# EAGLE schematic RPi-HAT_BUS-Controller_V0.3 (EAGLE 7.4.0)
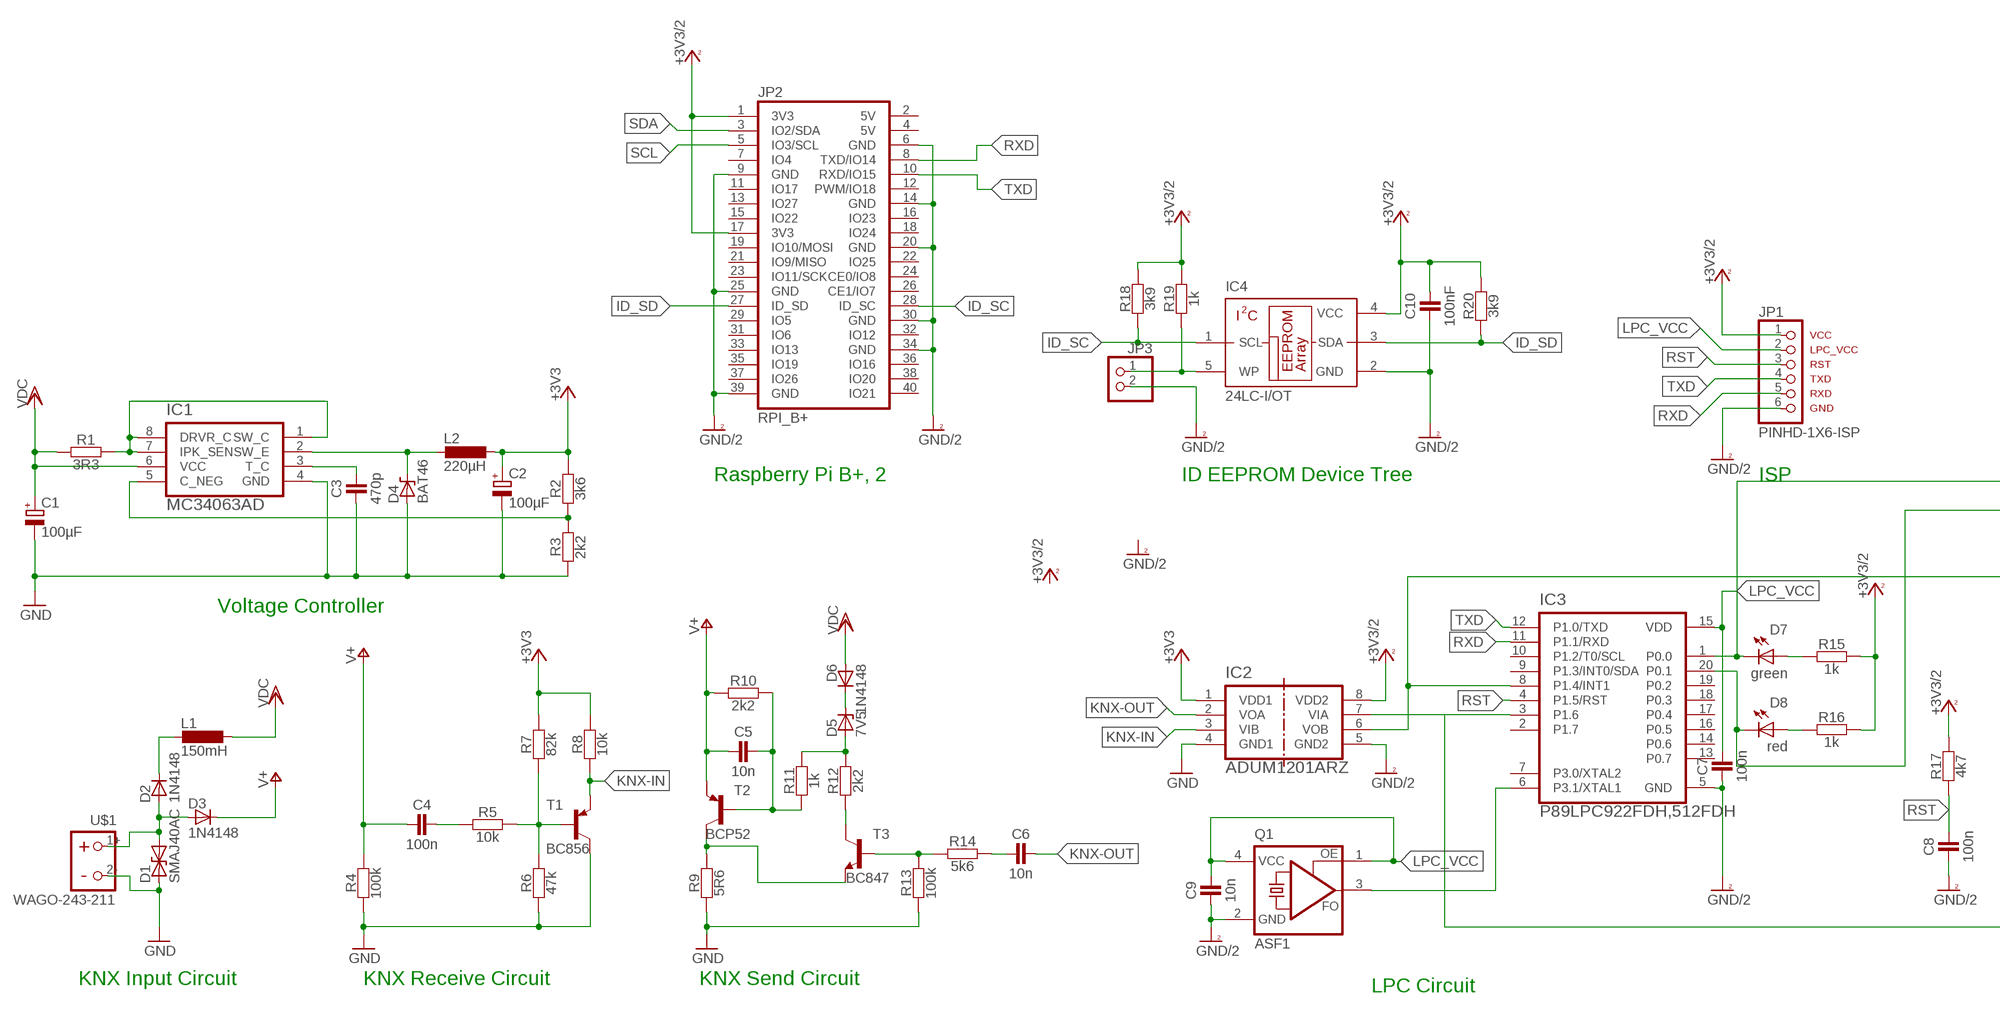
[diagram p0: schematic, sheet 1, part 1 of 2]
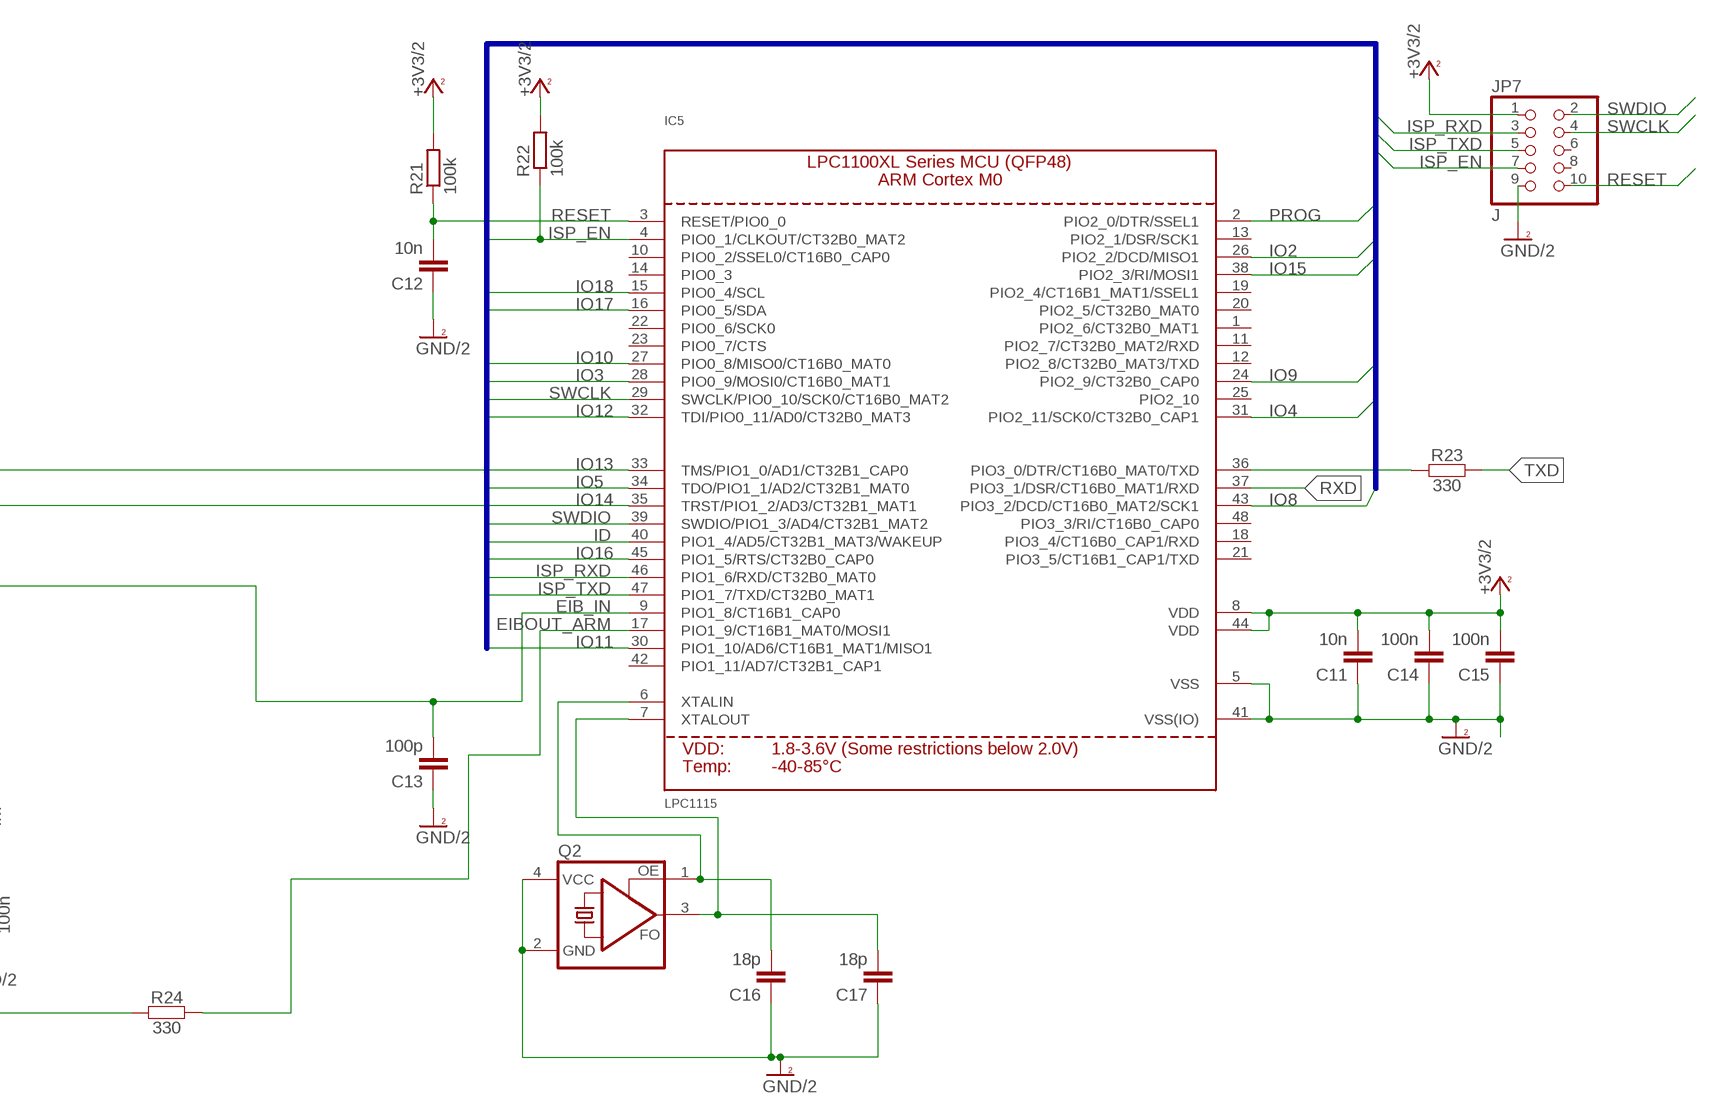
[diagram p1: schematic, sheet 1, part 2 of 2]

## Parts
C1  100µF  100µF,35V  [PANASONIC_D]
C2  100µF  100µF,6.3V  [PANASONIC_C]
C3  470p  CAPACITORC1206  [R1206]
C4  100n  CAPACITORC1206  [R1206]
C5  10n  CAPACITORC1206  [R1206]
C6  10n  CAPACITORC1206  [R1206]
C7  100n  CAPACITORC1206  [R1206]
C8  100n  CAPACITORC1206  [R1206]
C9  10n  CAPACITORC1206  [R1206]
C10  100nF  CAPACITORC1206  [R1206]
C11  10n  C-EUC1206  [C1206]
C12  10n  C-EUC1206  [C1206]
C13  100p  C-EUC1206  [C1206]
C14  100n  C-EUC1206  [C1206]
C15  100n  C-EUC1206  [C1206]
C16  18p  C-EUC1206  [C1206]
C17  18p  C-EUC1206  [C1206]
D1  SMAJ40AC  [DO-214AC]
D2  1N4148  1N4148MINIMELF  [MINIMELF]
D3  1N4148  1N4148MINIMELF  [MINIMELF]
D4  BAT46  [MINIMELF]
D5  7V5  Z-DIODE  [MINIMELF]
D6  1N4148  1N4148MINIMELF  [MINIMELF]
D7  green  LED1206  [CHIPLED_1206]
D8  red  LED1206  [CHIPLED_1206]
IC1  MC34063AD  [SOIC127P600X175-8N]
IC2  ADUM1201ARZ  [SOIC127P600X175-8N]
IC3  P89LPC922FDH,512FDH  [SOP65P640X110-20N]
IC4  24LC-I/OT  [SOT23-5]
IC5  LPC1115  LPC1113/4/5_QFP48_XLSERIES  [LQFP48]
JP1  PINHD-1X6-ISP  [1X06]
JP2  RPI_B+  [RPI-B+HAT]
JP3  PINHD-1X2  [1X02]
JP7  J  PINHD-2X05_2.00  [2X05M]
L1  150mH  150MH-L11PL1  [11P-L1]
L2  220µH  220µH-SMCC11.43  [2200-11.43]
Q1  ASF1  [ASF]
Q2  ASFL  [ASF]
R1  3R3  RESISTORR1206  [R1206]
R2  3k6  RESISTORR1206  [R1206]
R3  2k2  RESISTORR1206  [R1206]
R4  100k  RESISTORR1206  [R1206]
R5  10k  RESISTORR1206  [R1206]
R6  47k  RESISTORR1206  [R1206]
R7  82k  RESISTORR1206  [R1206]
R8  10k  RESISTORR1206  [R1206]
R9  5R6  RESISTORR1206  [R1206]
R10  2k2  RESISTORR1206  [R1206]
R11  1k  RESISTORR1206  [R1206]
R12  2k2  RESISTORR1206  [R1206]
R13  100k  RESISTORR1206  [R1206]
R14  5k6  RESISTORR1206  [R1206]
R15  1k  RESISTORR1206  [R1206]
R16  1k  RESISTORR1206  [R1206]
R17  4k7  RESISTORR1206  [R1206]
R18  3k9  RESISTORR1206  [R1206]
R19  1k  RESISTORR1206  [R1206]
R20  3k9  RESISTORR1206  [R1206]
R21  100k  R-EU_R1206  [R1206]
R22  100k  R-EU_R1206  [R1206]
R23  330  RESISTORR1206  [R1206]
R24  330  RESISTORR1206  [R1206]
T1  BC856  PNPBC856  [SOT23]
T2  BCP52  PNPBCP52  [SOT223]
T3  BC847  NPN-BC847  [SOT23]
U$1  WAGO-243-211  [WAGO-243-211]

## Nets
+3V3: C2.+ IC2.1(VDD1) L2.1 R2.2 R7.2 R8.2
+3V3/2: C10.2 C11.2 C14.2 C15.2 IC2.8(VDD2) IC4.4(VCC) IC5.8(VDD) IC5.44(VDD) JP1.1 JP2.1(3V3) JP2.17(3V3) JP7.1 R15.2 R16.2 R17.2 R18.2 R19.2 R20.2 R21.2 R22.2
EIB_IN: C13.2 IC2.6(VOB) IC3.8(P1.4/INT1) IC5.9(PIO1_8/CT16B1_CAP0)
EIB_OUT: IC2.7(VIA) IC3.3(P1.6) R24.1
EIBOUT_ARM: IC5.17(PIO1_9/CT16B1_MAT0/MOSI1) R24.2
GND: C1.- C2.- C3.1 D1.A D4.A IC1.4(GND) IC2.4(GND1) R3.1 R4.1 R6.1 R9.1 R13.1 T1.3(C) U$1.2-
GND/2: C7.1 C8.1 C9.1 C10.1 C11.1 C12.1 C13.1 C14.1 C15.1 C16.1 C17.1 IC2.5(GND2) IC3.5(GND) IC4.2(GND) IC5.5(VSS) IC5.41(VSS(IO)) JP1.6 JP2.6(GND) JP2.9(GND) JP2.14(GND) JP2.20(GND) JP2.25(GND) JP2.30(GND) JP2.34(GND) JP2.39(GND) JP3.2 JP7.9 Q1.2(GND) Q2.2(GND) Q2.4(VCC)
ID: IC5.40(PIO1_4/AD5/CT32B1_MAT3/WAKEUP)
ID_SC: IC4.1(SCL) JP2.28(ID_SC) R18.1
ID_SD: IC4.3(SDA) JP2.27(ID_SD) R20.1
IO2: IC5.26(PIO2_2/DCD/MISO1)
IO3: IC5.28(PIO0_9/MOSI0/CT16B0_MAT1)
IO4: IC5.31(PIO2_11/SCK0/CT32B0_CAP1)
IO5: IC5.34(TDO/PIO1_1/AD2/CT32B1_MAT0)
IO8: IC5.43(PIO3_2/DCD/CT16B0_MAT2/SCK1)
IO9: IC5.24(PIO2_9/CT32B0_CAP0)
IO10: IC5.27(PIO0_8/MISO0/CT16B0_MAT0)
IO11: IC5.30(PIO1_10/AD6/CT16B1_MAT1/MISO1)
IO12: D8.C IC3.20(P0.1) IC5.32(TDI/PIO0_11/AD0/CT32B0_MAT3)
IO13: IC5.33(TMS/PIO1_0/AD1/CT32B1_CAP0)
IO14: IC5.35(TRST/PIO1_2/AD3/CT32B1_MAT1)
IO15: D7.C IC3.1(P0.0) IC5.38(PIO2_3/RI/MOSI1)
IO16: IC5.45(PIO1_5/RTS/CT32B0_CAP0)
IO17: IC5.16(PIO0_5/SDA)
IO18: IC5.15(PIO0_4/SCL)
ISP_EN: IC5.4(PIO0_1/CLKOUT/CT32B0_MAT2) JP7.7 R22.1
ISP_RXD: IC5.46(PIO1_6/RXD/CT32B0_MAT0) JP7.3
ISP_TXD: IC5.47(PIO1_7/TXD/CT32B0_MAT1) JP7.5
KNX-IN: IC2.3(VIB) R8.1 T1.2(E)
KNX-OUT: C6.2 IC2.2(VOA)
LPC_VCC: C7.2 C9.2 IC3.15(VDD) JP1.2 Q1.1(OE) Q1.4(VCC)
N$1: D1.C D2.A D3.A U$1.1+
N$2: C16.2 IC5.6(XTALIN) Q2.1(OE)
N$3: IC1.5(C_NEG) R2.1 R3.2
N$4: C4.2 R5.1
N$5: D2.C L1.2
N$6: R5.2 R6.2 R7.1 T1.1(B)
N$7: C17.2 IC5.7(XTALOUT) Q2.3(FO)
N$8: IC1.1(SW_C) IC1.7(IPK_SEN) IC1.8(DRVR_C) R1.2
N$10: C3.2 IC1.3(T_C)
N$12: IC4.5(WP) JP3.1 R19.1
N$13: D4.C IC1.2(SW_E) L2.2
N$23: R9.2 T2.2(C) T2.4(C) T3.2(E)
N$24: C5.2 R10.2 R11.1 T2.1(B)
N$25: D5.A R11.2 R12.2
N$26: R12.1 T3.3(C)
N$28: R13.2 R14.1 T3.1(B)
N$29: C6.1 R14.2
N$31: D5.C D6.C
N$32: IC3.6(P3.1/XTAL1) Q1.3(FO)
N$35: D7.A R15.1
N$38: D8.A R16.1
PROG: IC5.2(PIO2_0/DTR/SSEL1)
RESET: C12.2 IC5.3(RESET/PIO0_0) JP7.10 R21.1
RST: C8.2 IC3.4(P1.5/RST) JP1.3 R17.1
RXD: IC3.11(P1.1/RXD) IC5.37(PIO3_1/DSR/CT16B0_MAT1/RXD) JP1.5 JP2.8(TXD/IO14)
SCL: JP2.5(IO3/SCL)
SDA: JP2.3(IO2/SDA)
SWCLK: IC5.29(SWCLK/PIO0_10/SCK0/CT16B0_MAT2) JP7.4
SWDIO: IC5.39(SWDIO/PIO1_3/AD4/CT32B1_MAT2) JP7.2
TXD: IC3.12(P1.0/TXD) JP1.4 JP2.10(RXD/IO15) R23.2
TXD_ARM: IC5.36(PIO3_0/DTR/CT16B0_MAT0/TXD) R23.1
V+: C4.1 C5.1 D3.C R4.2 R10.1 T2.3(E)
VDD: C1.+ D6.A IC1.6(VCC) L1.1 R1.1 ; supply symbol labelled VDC
Unconnected: IC3.2(P1.7) IC3.7(P3.0/XTAL2) IC3.9(P1.3/INT0/SDA) IC3.10(P1.2/T0/SCL) IC3.13(P0.7) IC3.14(P0.6) IC3.16(P0.5) IC3.17(P0.4) IC3.18(P0.3) IC3.19(P0.2) IC5.1(PIO2_6/CT32B0_MAT1) IC5.10(PIO0_2/SSEL0/CT16B0_CAP0) IC5.11(PIO2_7/CT32B0_MAT2/RXD) IC5.12(PIO2_8/CT32B0_MAT3/TXD) IC5.13(PIO2_1/DSR/SCK1) IC5.14(PIO0_3) IC5.18(PIO3_4/CT16B0_CAP1/RXD) IC5.19(PIO2_4/CT16B1_MAT1/SSEL1) IC5.20(PIO2_5/CT32B0_MAT0) IC5.21(PIO3_5/CT16B1_CAP1/TXD) IC5.22(PIO0_6/SCK0) IC5.23(PIO0_7/CTS) IC5.25(PIO2_10) IC5.42(PIO1_11/AD7/CT32B1_CAP1) IC5.48(PIO3_3/RI/CT16B0_CAP0) JP2.2(5V) JP2.4(5V) JP2.7(IO4) JP2.11(IO17) JP2.12(PWM/IO18) JP2.13(IO27) JP2.15(IO22) JP2.16(IO23) JP2.18(IO24) JP2.19(IO10/MOSI) JP2.21(IO9/MISO) JP2.22(IO25) JP2.23(IO11/SCK) JP2.24(CE0/IO8) JP2.26(CE1/IO7) JP2.29(IO5) JP2.31(IO6) JP2.32(IO12) JP2.33(IO13) JP2.35(IO19) JP2.36(IO16) JP2.37(IO26) JP2.38(IO20) JP2.40(IO21) JP7.6 JP7.8

## Buses
IO[1..18],RESET,SWCLK,SWDIO,ISP_EN,PROG,ID,ISP_TXD,ISP_RXD

## Notes on the sheet
- Raspberry Pi B+, 2 | ID EEPROM Device Tree | ISP
- Voltage Controller
- KNX Input Circuit | KNX Receive Circuit | KNX Send Circuit
- LPC Circuit

## Library data of the parts
C1 = RCL_for_Selfbus-Projects:100µF,35V: Polarized Capacitor 100µF, 35V
C2 = RCL_for_Selfbus-Projects:100µF,6.3V: Polarized Capacitor 100µF, 6.3V
C3-C10 = RCL_for_Selfbus-Projects:CAPACITOR: Capacitor
C11 C12 = rcl:C-EU: CAPACITOR, European symbol; REICHELT: X7R-G0805 10N
C13 = rcl:C-EU: CAPACITOR, European symbol; REICHELT: NPO-G0805 100P
C14 C15 = rcl:C-EU: CAPACITOR, European symbol; REICHELT: X7R-G0805 100N
C16 C17 = rcl:C-EU: CAPACITOR, European symbol
D1 = Diode:SMAJ40AC
D2 D3 = Diode:1N4148
D4 = Diode_for_Selfbus-Projects:BAT46: Schottky Diode
D5 = Diode_for_Selfbus-Projects:Z-DIODE: Z-Diode
D6 = Diode_for_Selfbus-Projects:1N4148: Diode
D7 D8 = Diode_for_Selfbus-Projects:LED: LED
IC1 = IC_for_Selfbus-Projects:MC34063A: DC/DC converter control circuit
IC2 = IC_for_Selfbus-Projects:ADUM1201ARZ: Dual-Channel Digital Isolators; MPN: ADUM1201ARZ; OC_FARNELL: 1078200; OC_NEWARK: 19M0753; PACKAGE: SOIC-8; SUPPLIER: Analog Devices
IC3 = IC_for_Selfbus-Projects:P89LPC922FDH,512: 8-bit microcontrollers with two-clock 80C51 core 2 kB/4 kB/8 kB 3 V low-power Flash with 256-byte data RAM; MPN: P89LPC922FDH,512; OC_FARNELL: 1895067; OC_NEWARK: 70R8570; PACKAGE: TSSOP-20; SUPPLIER: NXP
IC4 = IC_for_Selfbus-Projects:24LC*: Microchip I2C EEPROM 2 Kbit - 24LC02B - 24LC02BT-I/OTDKR-ND 32 Kbit- 24LC32A - 24LC32AT-I/OTDKR-ND; DIGIKEY: 24LC32AT-I/OTDKR-ND
IC5 = microbuilder:LPC1113/4/5_QFP48_XLSERIES: LPC1113/4/5 ARM Cortex M0 MCU (50MHz) - XL Series (FBD48/3x3) LPC1115FBD48/303: Max Frequency: 50MHz Flash: 64kB SRAM: 8kB ADC: 10-bit
JP1 = Connector_for_Selfbus-Projects:PINHD-1X6-ISP: PIN HEADER - ISP for Selfbus-Controller
JP2 = Connector_for_Selfbus-Projects:RPI_B+: RPi-B+ und RPi-B2 HAT
JP3 = Connector_for_Selfbus-Projects:PINHD-1X2: PIN HEADER
JP7 = pinhead-2:PINHD-2X05: PIN HEADER; REICHELT: MPE 150-3-010
L1 = RCL_for_Selfbus-Projects:150MH-L11P: Inductor 150mH
L2 = RCL_for_Selfbus-Projects:220µH-SMCC: Inductor 220µH
Q1 = IC_for_Selfbus-Projects:ASF*: CRYSTAL CLOCK OSCILLATORS 5.0 Vdc or 3.3 Vdc - LOW PROFILE ULTRA MINIATURE CERAMIC SURFACE MOUNT Source: http://www.abracon.com/Oscillators/asf1-L-L1.pdf; OC_FARNELL: unknown; OC_NEWARK: unknown
Q2 = crystal:ASF*: CRYSTAL CLOCK OSCILLATORS 5.0 Vdc or 3.3 Vdc - LOW PROFILE ULTRA MINIATURE CERAMIC SURFACE MOUNT Source: http://www.abracon.com/Oscillators/asf1-L-L1.pdf
R1-R20 R23 R24 = RCL_for_Selfbus-Projects:RESISTOR: Resistor
R21 R22 = rcl:R-EU_: RESISTOR, European symbol; REICHELT: SMD-0805 100K
T1 T2 = Transistor_for_Selfbus-Projects:PNP: PNP Transistor
T3 = Transistor_for_Selfbus-Projects:NPN: NPN Transistor
U$1 = Connector_for_Selfbus-Projects:WAGO-243-211: WAGO KNX-Busklemme